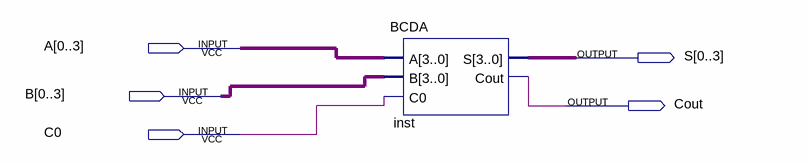
[diagram p0: schematic sheet]
// Quartus schematic Block_for_BCDA.bdf as structural Verilog: 1 symbols, 5 pins
module Block_for_BCDA (
  input  [0:3] A,
  input  [0:3] B,
  input  C0,
  output [0:3] S,
  output Cout
);

  BCDA inst (.A(A), .B(B), .C0(C0), .S(S), .Cout(Cout));
endmodule
